# Altium schematic sheet Output Channels.SchDoc: Output Channels
size Letter; SheetNumber: 22
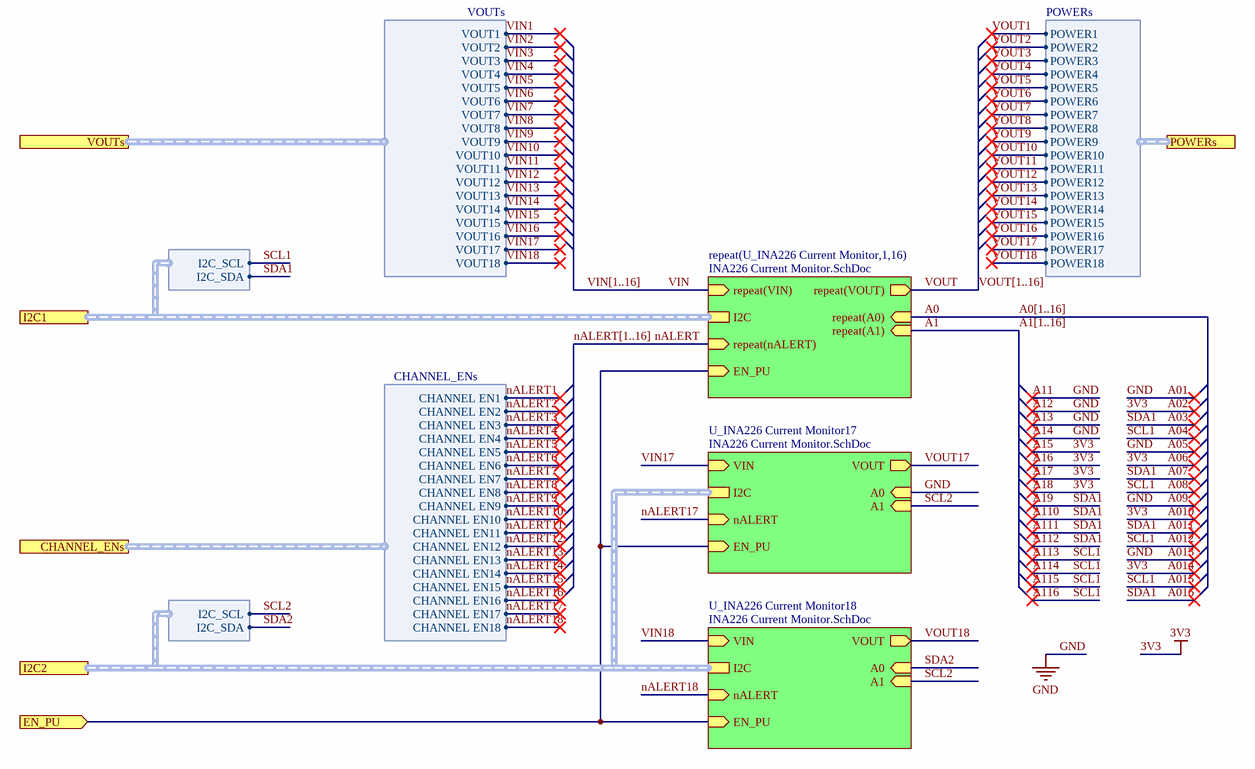
[diagram p0: Output Channels.SchDoc]

## Sub-sheets
repeat(U_INA226 Current Monitor,1,16) = INA226 Current Monitor.SchDoc: repeat(VIN) (in), repeat(VOUT) (out), I2C (harness LTC4316_I2CIN), repeat(A0) (in), repeat(A1) (in), repeat(nALERT) (in), EN_PU (in)
U_INA226 Current Monitor17 = INA226 Current Monitor.SchDoc: VIN (in), VOUT (out), I2C (harness LTC4316_I2CIN), A0 (in), A1 (in), nALERT (in), EN_PU (in)
U_INA226 Current Monitor18 = INA226 Current Monitor.SchDoc: VIN (in), VOUT (out), I2C (harness LTC4316_I2CIN), A0 (in), A1 (in), nALERT (in), EN_PU (in)

## Ports
CHANNEL_ENs (harness CHANNEL_ENs), EN_PU (in), I2C1 (harness LTC4316_I2CIN), I2C2 (harness LTC4316_I2CIN), POWERs (harness POWERs), VOUTs (harness VOUTs)

## Harnesses
LTC4316_I2CIN: I2C_SCL, I2C_SDA
CHANNEL_ENs: CHANNEL EN1, CHANNEL EN2, CHANNEL EN3, CHANNEL EN4, CHANNEL EN5, CHANNEL EN6, CHANNEL EN7, CHANNEL EN8, CHANNEL EN9, CHANNEL EN10, CHANNEL EN11, CHANNEL EN12, CHANNEL EN13, CHANNEL EN14, CHANNEL EN15, CHANNEL EN16, CHANNEL EN17, CHANNEL EN18
VOUTs: VOUT1, VOUT2, VOUT3, VOUT4, VOUT5, VOUT6, VOUT7, VOUT8, VOUT9, VOUT10, VOUT11, VOUT12, VOUT13, VOUT14, VOUT15, VOUT16, VOUT17, VOUT18
POWERs: POWER1, POWER2, POWER3, POWER4, POWER5, POWER6, POWER7, POWER8, POWER9, POWER10, POWER11, POWER12, POWER13, POWER14, POWER15, POWER16, POWER17, POWER18

## Nets
A01: sheet U_INA226 Current Monitor17/A0  [also labelled A013, A05, A09, A11, A12, A13, A14, GND]
A0: sheet repeat(U_INA226 Current Monitor,1,16)/repeat(A0)
A1: sheet repeat(U_INA226 Current Monitor,1,16)/repeat(A1)
A011: port I2C1.I2C_SDA  [also labelled A016, A03, A07, A110, A111, A112, A19, SDA1]
A012: port I2C1.I2C_SCL  [also labelled A015, A04, A08, A113, A114, A115, A116, SCL1]
EN_PU: port EN_PU, sheet repeat(U_INA226 Current Monitor,1,16)/EN_PU, sheet U_INA226 Current Monitor17/EN_PU, sheet U_INA226 Current Monitor18/EN_PU
nALERT: sheet repeat(U_INA226 Current Monitor,1,16)/repeat(nALERT)
nALERT1: port CHANNEL_ENs.CHANNEL EN1
nALERT2: port CHANNEL_ENs.CHANNEL EN2
nALERT3: port CHANNEL_ENs.CHANNEL EN3
nALERT4: port CHANNEL_ENs.CHANNEL EN4
nALERT5: port CHANNEL_ENs.CHANNEL EN5
nALERT6: port CHANNEL_ENs.CHANNEL EN6
nALERT7: port CHANNEL_ENs.CHANNEL EN7
nALERT8: port CHANNEL_ENs.CHANNEL EN8
nALERT9: port CHANNEL_ENs.CHANNEL EN9
nALERT10: port CHANNEL_ENs.CHANNEL EN10
nALERT11: port CHANNEL_ENs.CHANNEL EN11
nALERT12: port CHANNEL_ENs.CHANNEL EN12
nALERT13: port CHANNEL_ENs.CHANNEL EN13
nALERT14: port CHANNEL_ENs.CHANNEL EN14
nALERT15: port CHANNEL_ENs.CHANNEL EN15
nALERT16: port CHANNEL_ENs.CHANNEL EN16
nALERT17: sheet U_INA226 Current Monitor17/nALERT, port CHANNEL_ENs.CHANNEL EN17
nALERT18: sheet U_INA226 Current Monitor18/nALERT, port CHANNEL_ENs.CHANNEL EN18
SCL2: sheet U_INA226 Current Monitor17/A1, sheet U_INA226 Current Monitor18/A1, port I2C2.I2C_SCL
SDA2: sheet U_INA226 Current Monitor18/A0, port I2C2.I2C_SDA
VIN: sheet repeat(U_INA226 Current Monitor,1,16)/repeat(VIN)
VIN1: port VOUTs.VOUT1
VIN2: port VOUTs.VOUT2
VIN3: port VOUTs.VOUT3
VIN4: port VOUTs.VOUT4
VIN5: port VOUTs.VOUT5
VIN6: port VOUTs.VOUT6
VIN7: port VOUTs.VOUT7
VIN8: port VOUTs.VOUT8
VIN9: port VOUTs.VOUT9
VIN10: port VOUTs.VOUT10
VIN11: port VOUTs.VOUT11
VIN12: port VOUTs.VOUT12
VIN13: port VOUTs.VOUT13
VIN14: port VOUTs.VOUT14
VIN15: port VOUTs.VOUT15
VIN16: port VOUTs.VOUT16
VIN17: sheet U_INA226 Current Monitor17/VIN, port VOUTs.VOUT17
VIN18: sheet U_INA226 Current Monitor18/VIN, port VOUTs.VOUT18
VOUT: sheet repeat(U_INA226 Current Monitor,1,16)/repeat(VOUT)
VOUT1: port POWERs.POWER1
VOUT2: port POWERs.POWER2
VOUT3: port POWERs.POWER3
VOUT4: port POWERs.POWER4
VOUT5: port POWERs.POWER5
VOUT6: port POWERs.POWER6
VOUT7: port POWERs.POWER7
VOUT8: port POWERs.POWER8
VOUT9: port POWERs.POWER9
VOUT10: port POWERs.POWER10
VOUT11: port POWERs.POWER11
VOUT12: port POWERs.POWER12
VOUT13: port POWERs.POWER13
VOUT14: port POWERs.POWER14
VOUT15: port POWERs.POWER15
VOUT16: port POWERs.POWER16
VOUT17: sheet U_INA226 Current Monitor17/VOUT, port POWERs.POWER17
VOUT18: sheet U_INA226 Current Monitor18/VOUT, port POWERs.POWER18

## Buses and harness runs
bus A0[1..16]
bus A1[1..16]
bus nALERT[1..16]
bus VIN[1..16]
bus VOUT[1..16]
harness port I2C1 = sheet repeat(U_INA226 Current Monitor,1,16)/I2C
harness port I2C2 = sheet U_INA226 Current Monitor17/I2C = sheet U_INA226 Current Monitor18/I2C

## Notes on the sheet
- (the "License"); you may not use or redistribute this file except in compliance with the License. You
- This file and the information within it are licensed under the terms of the Apache License, Version 2.0
- Copyright
- Unless required by applicable law or agreed to in writing, content distributed under the License is
- distributed on an "AS IS" BASIS, WITHOUT WARRANTIES OR CONDITIONS OF ANY KIND,
- either express or implied. See the License for the specific language governing permissions and
- limitations under the License.
- may obtain a copy of the License at:
- http://www.apache.org/licenses/LICENSE-2.0
- Title
- Size:
- Date:
- Letter
- Number:
- Time:
- Revision:
- Sheet
- of
- University of Alberta
- Deptartment of Electrical
- and Computer Engineering
- Edmonton AB, Canada
- T6G 1H9
- File: